# EAGLE schematic Mikrobus-Cobbler2 (EAGLE 6.6.0)
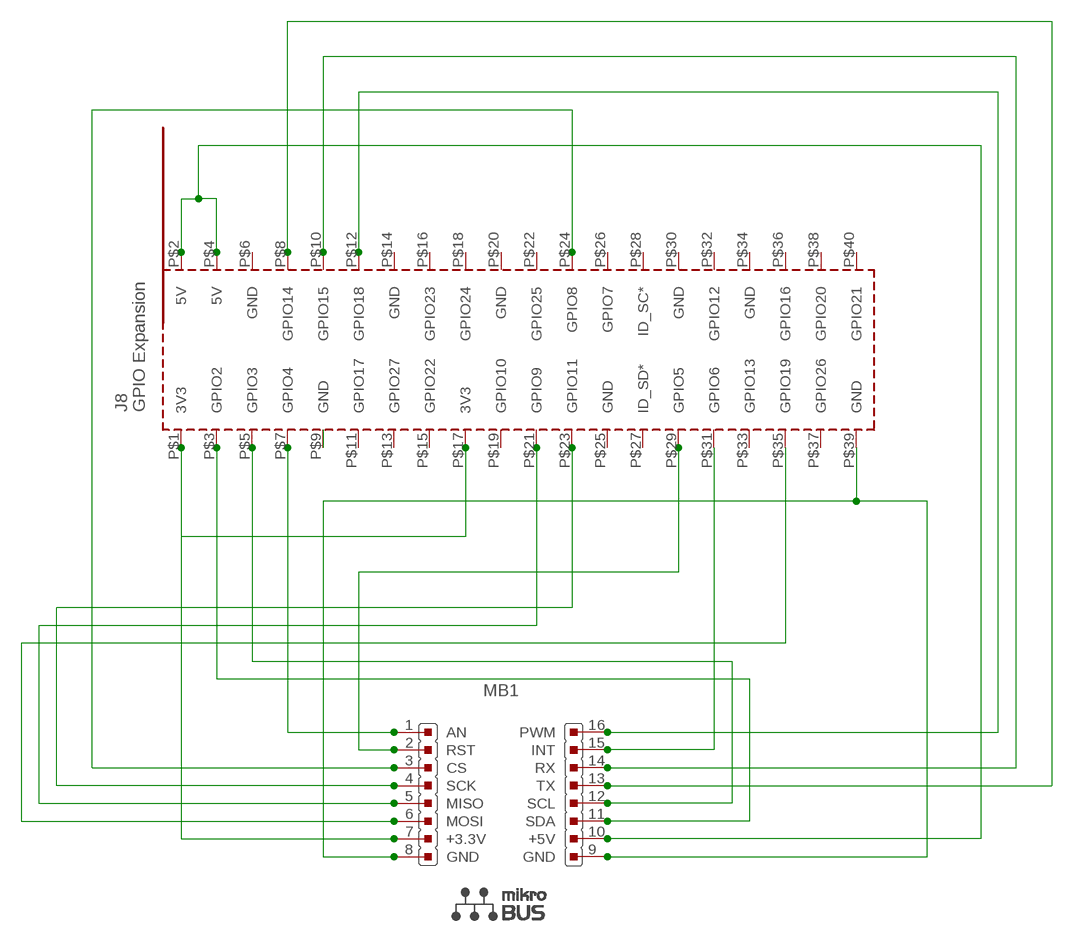
[diagram p0: schematic, sheet 1]

## Parts
MB1  MIKROBUSFOR-COBBLER  [MIKROBUS-COBBLER]
PCB1  RPI2-HEADER  [RPI2-HEADER]

## Nets
N$1: MB1.8(GND) MB1.9(GND) PCB1.P$39(GND)
N$2: MB1.10(+5V) PCB1.P$2(5V) PCB1.P$4(5V)
N$3: MB1.7(+3.3V) PCB1.P$1(3V3) PCB1.P$17(3V3)
N$4: MB1.1(AN) PCB1.P$7(GPIO4)
N$5: MB1.2(RST) PCB1.P$29(GPIO5)
N$6: MB1.4(SCK) PCB1.P$23(GPIO11)
N$7: MB1.3(CS) PCB1.P$24(GPIO8)
N$8: MB1.5(MISO) PCB1.P$21(GPIO9)
N$9: MB1.6(MOSI) PCB1.P$35(GPIO19)
N$10: MB1.16(PWM) PCB1.P$12(GPIO18)
N$11: MB1.15(INT) PCB1.P$31(GPIO6)
N$12: MB1.14(RX) PCB1.P$10(GPIO15)
N$13: MB1.13(TX) PCB1.P$8(GPIO14)
N$14: MB1.12(SCL) PCB1.P$5(GPIO3)
N$15: MB1.11(SDA) PCB1.P$3(GPIO2)
N$16: PCB1.P$9(GND)
Unconnected: PCB1.P$6(GND) PCB1.P$11(GPIO17) PCB1.P$13(GPIO27) PCB1.P$14(GND) PCB1.P$15(GPIO22) PCB1.P$16(GPIO23) PCB1.P$18(GPIO24) PCB1.P$19(GPIO10) PCB1.P$20(GND) PCB1.P$22(GPIO25) PCB1.P$25(GND) PCB1.P$26(GPIO7) PCB1.P$27(ID_SD*) PCB1.P$28(ID_SC*) PCB1.P$30(GND) PCB1.P$32(GPIO12) PCB1.P$33(GPIO13) PCB1.P$34(GND) PCB1.P$36(GPIO16) PCB1.P$37(GPIO26) PCB1.P$38(GPIO20) PCB1.P$40(GPIO21)

## Library data of the parts
MB1 = KS Proto:MIKROBUS: MikroBUS Source: MikroBUS specification <http://www.mikroe.com/downloads/get/1737/mikrobus_specification.pdf> MikroBUS <http://www.mikroe.com/mikrobus/>
PCB1 = KS Proto:RPI2-HEADER: Device for Raspberry Pi 2 board created by www.element14.com More information and support community is available at http://www.element14.com/community/community/raspberry-pi/raspberrypi2